# EAGLE design esquema (EAGLE 7.5.0)
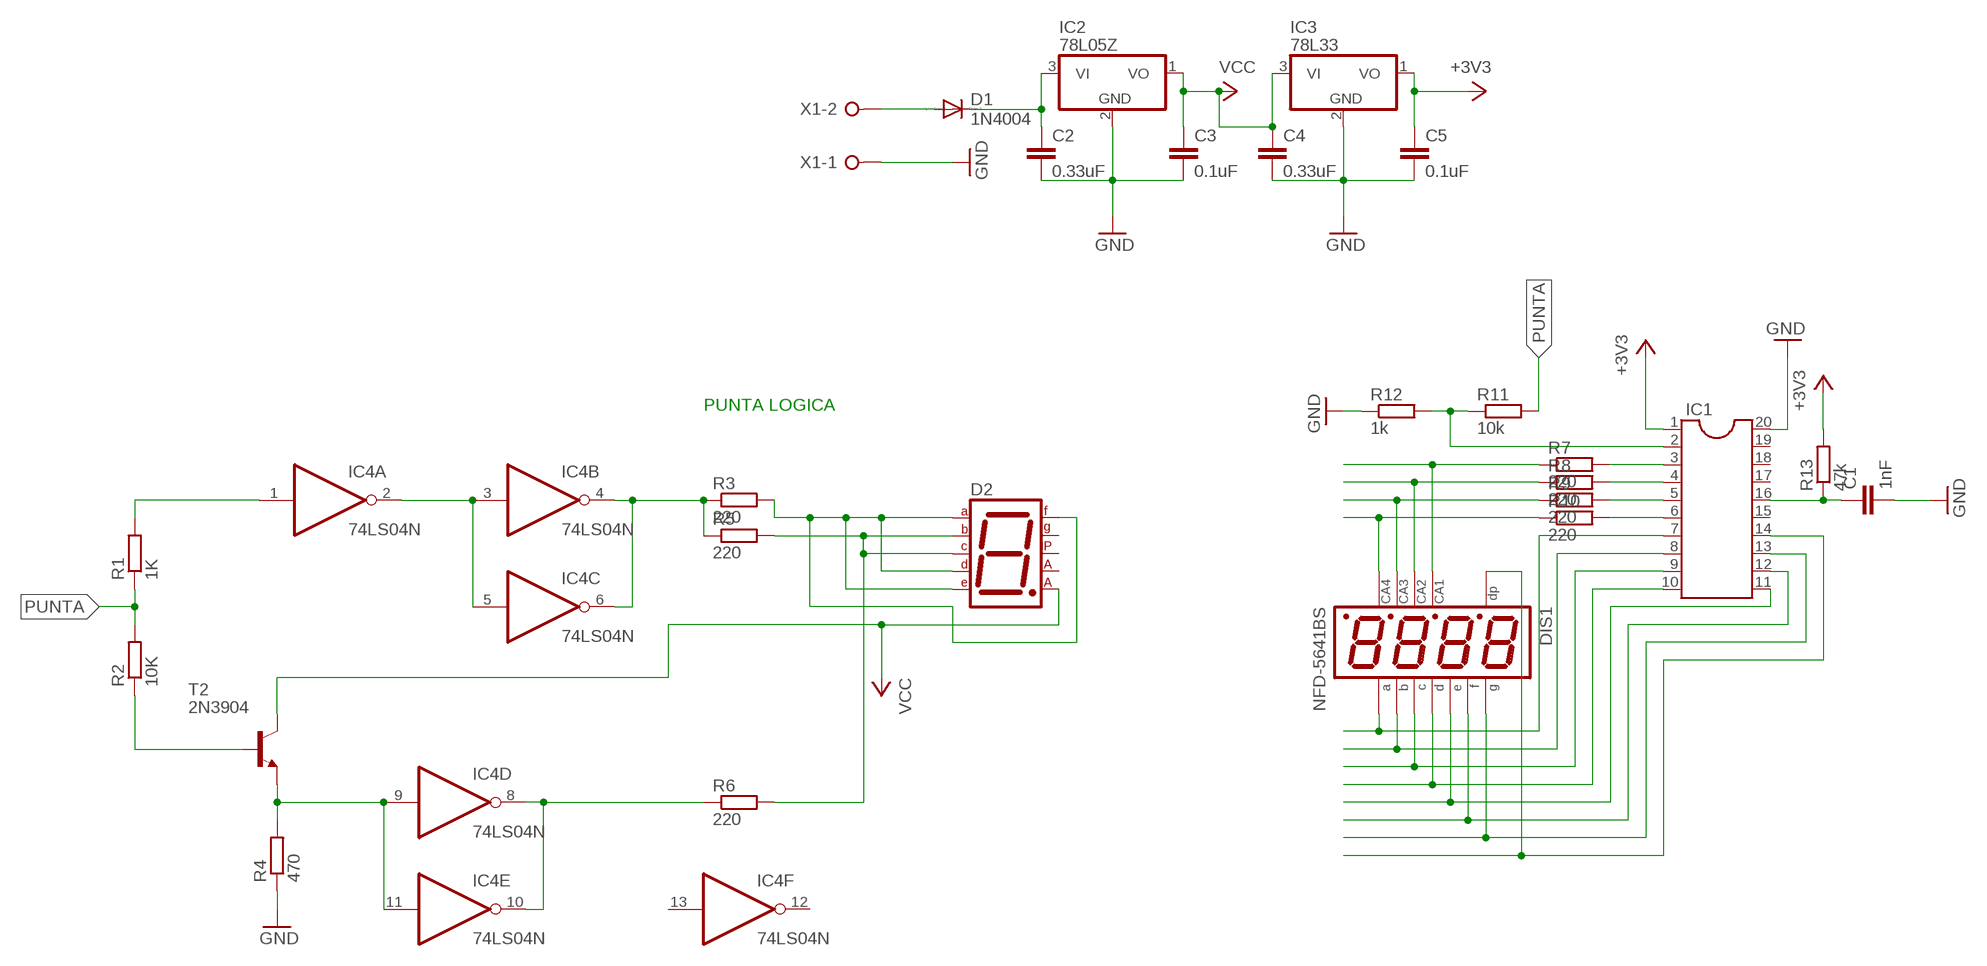
[diagram p0: schematic, sheet 1]

## Parts
C1  1nF  C-EU050-024X044  [C050-024X044]
C2  0.33uF  C-EU050-024X044  [C050-024X044]
C3  0.1uF  C-EU050-024X044  [C050-024X044]
C4  0.33uF  C-EU050-024X044  [C050-024X044]
C5  0.1uF  C-EU050-024X044  [C050-024X044]
D1  1N4004  [DO41-10]
D2  7SEG-CA  [7SEG-13]
DIS1  NFD-5641BS  [NFD-5641]
IC1  DIL20S  [SOCKET-20]
IC2  78L05Z  [TO92]
IC3  78L33  78L05Z  [TO92]
IC4  74LS04N  [DIL14]
R1  1K  R-EU_0207/7  [0207/7]
R2  10K  R-EU_0207/7  [0207/7]
R3  220  R-EU_0207/7  [0207/7]
R4  470  R-EU_0207/7  [0207/7]
R5  220  R-EU_0207/7  [0207/7]
R6  220  R-EU_0207/7  [0207/7]
R7  220  R-EU_0207/7  [0207/7]
R8  220  R-EU_0207/7  [0207/7]
R9  220  R-EU_0207/7  [0207/7]
R10  220  R-EU_0207/7  [0207/7]
R11  10k  R-EU_0207/7  [0207/7]
R12  1k  R-EU_0207/7  [0207/7]
R13  47k  R-EU_0207/7  [0207/7]
T2  2N3904  [TO92]
X1  W237-02P  [W237-132]

## Nets
+3V3: C5.1 IC1.1 IC3.1(VO) R13.2
GND: C1.2 C2.2 C3.2 C4.2 C5.2 IC1.20 IC2.2(GND) IC3.2(GND) R4.1 R12.1 X1.1
N$1: C1.1 IC1.16 R13.1
N$2: IC1.6 R10.2
N$3: IC1.5 R9.2
N$4: IC1.4 R8.2
N$5: IC1.3 R7.2
N$6: IC1.2 R11.1 R12.2
N$7: DIS1.P$12 R7.1
N$8: DIS1.P$9 R8.1
N$9: DIS1.P$8 R9.1
N$10: IC4.1(A:I) R1.2
N$11: IC4.2(A:O) IC4.3(B:I) IC4.5(C:I)
N$12: IC4.4(B:O) IC4.6(C:O) R3.1 R5.1
N$13: R2.1 T2.2(B)
N$14: IC4.9(D:I) IC4.11(E:I) R4.2 T2.3(E)
N$15: D2.1(E) D2.2(D) D2.7(A) D2.9(F) R3.2
N$16: IC4.8(D:O) IC4.10(E:O) R6.1
N$17: D2.4(C) D2.6(B) R5.2 R6.2
N$18: DIS1.P$6 R10.1
N$19: DIS1.P$11 IC1.7
N$20: DIS1.P$7 IC1.8
N$21: DIS1.P$4 IC1.9
N$22: DIS1.P$2 IC1.10
N$23: DIS1.P$1 IC1.11
N$24: DIS1.P$10 IC1.12
N$25: DIS1.P$5 IC1.13
N$26: DIS1.P$3 IC1.14
N$27: D1.A X1.2
N$28: C2.1 D1.C IC2.3(VI)
PUNTA: R1.1 R2.2 R11.2
VCC: C3.1 C4.1 D2.8(CA2) IC2.1(VO) IC3.3(VI) T2.1(C)
Unconnected: D2.3(CA1) D2.5(DP) D2.10(G) IC1.15 IC1.17 IC1.18 IC1.19 IC4.12(F:O) IC4.13(F:I)

## Notes on the sheet
- PUNTA LOGICA

## Power pins joined to a net without a drawn wire
GND: IC4.7(P:GND)
VCC: IC4.14(P:VCC)

## Library data of the parts
C1-C5 = rcl:C-EU: CAPACITOR, European symbol
D1 = diode:1N4004: DIODE general purpose rectifier, 1 A
D2 = special:7SEG-CA: 7-segment DISPLAY single anode, 13 mm
DIS1 = display-nfd:NFD-5641BS: Four Digit 0.56" CA Seven-Segment LED Display Futurlec part number: 7FR5641BS Created by RobG
IC1 = ic-package:DIL20: Dual In Line / Socket
IC2 IC3 = linear:78*: Positive VOLTAGE REGULATOR Source: http://cache.national.com/ds/LM/LM78L05.pdf http://www.fairchildsemi.com/ds/LM/LM7805.pdf
IC4 = 74xx-us:74*04: Hex INVERTER
R1-R13 = rcl:R-EU_: RESISTOR, European symbol
T2 = transistor:2N3904: NPN TRANSISTOR
X1 = con-wago-508:W237-02P: WAGO SREW CLAMP; OC_FARNELL: unknown; OC_NEWARK: unknown

## Board
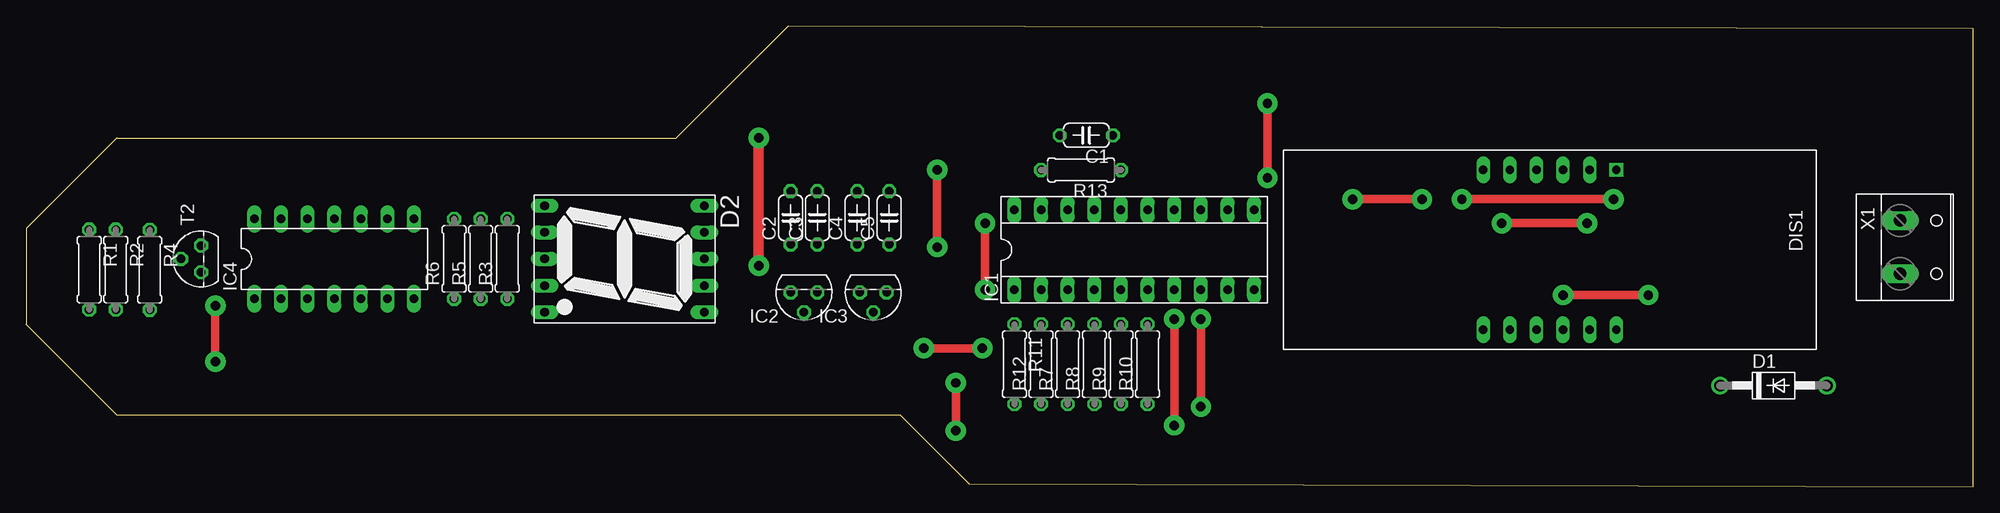
[diagram p1: board, top side]
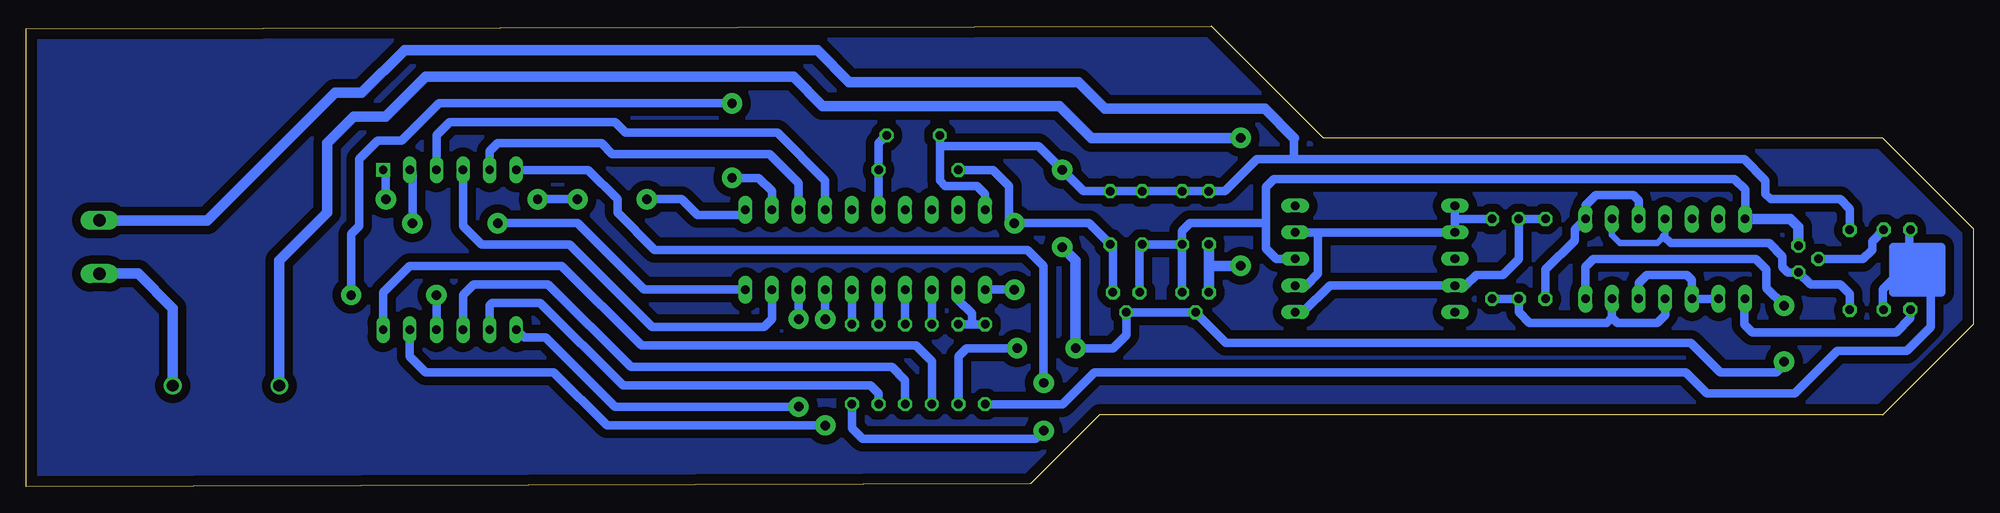
[diagram p2: board, bottom side, seen from below]

Size 185.67 x 43.94 mm. Coordinates in mm from the lower left corner, seen from the top.
Outline: 0,24.64 0,15.49 8.64,6.86 83.31,6.86 89.92,0.25 185.67,0 185.67,43.69 72.64,43.94 61.98,33.27 8.64,33.27 0,24.64
Copper layers (1*16): Top 0.035mm / dielectric 1.5mm / Bottom 0.035mm
Design rules "default": minimum track width 10mil, minimum drill 24mil, track to track 8mil, track to pad 8mil, pad to pad 8mil, via to via 8mil, smd to smd 8mil, copper to edge 40mil, drill to drill 8mil, minimum pad ring 10mil, minimum via ring 8mil, stop-mask expansion 4mil, vias tented up to drill 0mil, thermal gap 10mil

### Footprints (pad centres in the part's own frame; a part is rotated, then mirrored left to right if it is on the bottom)
C050-024X044 = drill 0.813 octagon: 1 -2.54,0; 2 2.54,0
DO41-10 = drill 1.118: A 5.08,0; C -5.08,0
7SEG-13 = drill 0.813 long: 1 -5.08,-7.62; 2 -2.54,-7.62; 3 0,-7.62; 4 2.54,-7.62; 5 5.08,-7.62; 6 5.08,7.62; 7 2.54,7.62; 8 0,7.62; 9 -2.54,7.62; 10 -5.08,7.62
NFD-5641 = drill 0.8 square: P$1 -6.35,-7.62 | drill 0.8 long: P$2 -3.81,-7.62; P$3 -1.27,-7.62; P$4 1.27,-7.62; P$5 3.81,-7.62; P$6 6.35,-7.62; P$7 6.35,7.62; P$8 3.81,7.62; P$9 1.27,7.62; P$10 -1.27,7.62; P$11 -3.81,7.62; P$12 -6.35,7.62
SOCKET-20 = drill 0.813 long: 1 -11.43,-3.81; 2 -8.89,-3.81; 3 -6.35,-3.81; 4 -3.81,-3.81; 5 -1.27,-3.81; 6 1.27,-3.81; 7 3.81,-3.81; 8 6.35,-3.81; 9 8.89,-3.81; 10 11.43,-3.81; 11 11.43,3.81; 12 8.89,3.81; 13 6.35,3.81; 14 3.81,3.81; 15 1.27,3.81; 16 -1.27,3.81; 17 -3.81,3.81; 18 -6.35,3.81; 19 -8.89,3.81; 20 -11.43,3.81
TO92 = drill 0.813 octagon: 1 -1.27,0; 2 0,1.905; 3 1.27,0
DIL14 = drill 0.813 long: 1 -7.62,-3.81; 2 -5.08,-3.81; 3 -2.54,-3.81; 4 0,-3.81; 5 2.54,-3.81; 6 5.08,-3.81; 7 7.62,-3.81; 8 7.62,3.81; 9 5.08,3.81; 10 2.54,3.81; 11 0,3.81; 12 -2.54,3.81; 13 -5.08,3.81; 14 -7.62,3.81
0207/7 = drill 0.813 octagon: 1 -3.81,0; 2 3.81,0
TO92' = drill 0.813 octagon: 1 1.27,0; 2 0,1.905; 3 -1.27,0
W237-132 = drill 1.194 long: 1 -2.54,-0.635; 2 2.54,-0.635

### Placement (x,y rotation side)
C1  101.09,33.53 180 top
C2  72.9,25.65 90 top
C3  75.44,25.65 90 top
C4  79.25,25.65 90 top
C5  82.3,25.65 90 top
D1  166.62,9.65 0 top
D2  57.06,21.73 270 top
DIS1  145.29,22.61 180 top
IC1  105.66,22.61 0 top
IC2  74.17,18.54 180 top
IC3  80.77,18.54 180 top
IC4  29.37,21.73 0 top
R1  6,20.72 270 top
R2  8.54,20.72 270 top
R3  45.88,21.73 90 top
R4  11.78,20.69 270 top
R5  43.34,21.73 90 top
R6  40.8,21.73 90 top
R7  99.31,11.68 90 top
R8  101.85,11.68 90 top
R9  104.39,11.68 90 top
R10  106.93,11.68 90 top
R11  94.23,11.68 270 top
R12  96.77,11.68 90 top
R13  100.58,30.23 180 top
T2  2N3904  [TO92']  16.67,21.73 90 top
X1  179.32,22.86 270 top

### Tracks (layer width: path | path; a pad name or v marks a point on that pad's centre or on a via)
+3V3  (via drill 0.9 pad 1.93)
  Top 0.813: v91.44,18.8 v91.44,25.15
  Bottom 0.813: R13.2 93.47,30.23 91.95,28.7 91.95,25.65 v91.44,25.15 84.33,25.15 C5.1 82.04,22.86 IC3.1 | IC1.1 v91.44,18.8
GND  (via drill 0.9 pad 1.93)
  Top 0.813: v18.03,17.27 v18.03,11.94 | v91.19,13.21 v85.6,13.21 | v86.87,22.86 v86.87,30.23
  Bottom 0.813: IC4.7 36.99,20.97 36.23,21.73 20.73,21.73 19.72,20.72 19.72,18.96 v18.03,17.27 | C1.2 98.55,32.51 | 98.55,32.51 98.55,29.21 98.04,28.7 95,28.7 94.23,27.94 IC1.20 | 65.02,31.24 68.33,31.24 71.37,28.19 C2.2 C3.2 C4.2 C5.2 84.84,28.19 v86.87,30.23 89.15,32.51 98.55,32.51 | 65.02,31.24 21.84,31.24 19.81,29.21 19.81,27.94 19.3,27.43 12.7,27.43 11.78,26.51 R4.1 | v18.03,11.94 18.03,11.68 18.8,10.92 24.13,10.92 26.92,13.72 71.25,13.72 IC2.2 IC3.2 80.77,14.48 82.04,13.21 v85.6,13.21 | R12.1 96.77,12.45 96.01,13.21 v91.19,13.21 | 64.77,33.27 64.77,31.5 65.02,31.24
  Bottom 1.016: 64.77,33.27 67.56,36.07 82.8,36.07 85.34,38.61 107.19,38.61 110.24,41.66 149.61,41.66 153.67,37.59 156.21,37.59 168.4,25.4 X1.1 | v85.6,13.21 85.6,21.59 v86.87,22.86
N$1
  Bottom 0.813: IC1.16 R13.1 104.39,32.77 C1.1
N$2
  Bottom 0.813: IC1.6 R10.2
N$3
  Bottom 0.813: IC1.5 R9.2
N$4
  Bottom 0.813: IC1.4 R8.2
N$5
  Bottom 0.813: IC1.3 R7.2
N$6
  Bottom 0.813: R11.1 95.5,15.49 | 95.5,15.49 R12.2 | IC1.2 96.77,17.78 95.5,16.51 95.5,15.49
N$7
  Bottom 0.813: R7.1 99.31,11.94 100.84,13.46 127,13.46 134.62,21.08 149.1,21.08 151.64,18.54 DIS1.P$12
N$8
  Bottom 0.813: R8.1 101.85,10.16 103.12,11.43 128.02,11.43 135.89,19.3 143,19.3 144.02,18.29 DIS1.P$9
N$9
  Bottom 0.813: R9.1 104.39,8.89 105.16,9.65 128.78,9.65 136.65,17.53 141.22,17.53 141.48,17.27 DIS1.P$8
N$10
  Bottom 0.813: R1.2 6,16.1 7.37,14.73 21.08,14.73 21.84,15.49 21.84,17.83 IC4.1
N$11
  Bottom 0.813: IC4.2 IC4.3 26.83,19.7 27.34,20.21 31.15,20.21 31.91,19.45 IC4.5
N$12
  Bottom 0.813: IC4.4 29.37,16.4 30.13,15.64 33.94,15.64 34.45,16.14 | 34.45,16.14 IC4.6 | 34.45,16.14 34.96,15.64 42.32,15.64 43.34,16.65 R5.1 R3.1
N$13
  Bottom 0.813: T2.2 10.53,21.73 9.65,22.61 9.65,23.42 R2.1
N$14
  Bottom 0.61: IC4.11 29.37,24.02 29.5,23.89 30.13,23.26 33.69,23.26 34.45,24.02 IC4.9
  Bottom 0.813: 29.5,23.89 28.86,23.26 19.46,23.26 18.19,21.99 18.19,20.97 17.69,20.46 T2.3 15.51,19.3 12.7,19.3 11.78,18.38 R4.2
N$15
  Bottom 0.813: 64.93,19.19 D2.7 63.61,19.19 62.48,20.32 62.48,24.27 | D2.9 63.91,24.27 63.79,24.15 63.66,24.27 62.48,24.27 | 62.48,24.27 D2.2 49.44,25.4 | D2.1 49.44,25.4 | R3.2 49.29,25.54 49.44,25.4
N$16
  Bottom 0.813: IC4.10 31.91,27.32 32.42,27.83 35.97,27.83 36.99,26.81 IC4.8 38.01,24.53 38.01,23.51 40.8,20.72 R6.1
N$17
  Bottom 0.813: R6.2 R5.2 43.34,21.73 44.86,20.21 47.4,20.21 48.42,19.19 D2.4 61.37,19.19 63.91,16.65 D2.6
N$18  (via drill 0.9 pad 1.93)
  Top 0.813: v88.65,5.33 v88.65,9.91
  Bottom 0.813: DIS1.P$6 132.08,30.23 129.29,27.43 129.29,26.16 125.73,22.61 90.17,22.61 88.65,21.08 v88.65,9.91 | R10.1 106.93,5.59 105.92,4.57 89.41,4.57 v88.65,5.33
N$19  (via drill 0.9 pad 1.93)
  Top 0.813: v109.47,16 v109.47,5.84
  Bottom 0.813: IC1.7 v109.47,16 | DIS1.P$11 149.1,12.45 147.57,10.92 135.38,10.92 130.3,5.84 v109.47,5.84
N$20  (via drill 0.9 pad 1.93)
  Top 0.813: v112.01,16 v112.01,7.62
  Bottom 0.813: IC1.8 v112.01,16 | v112.01,7.62 129.54,7.62 136.14,14.22 138.18,14.22 DIS1.P$7
N$21
  Bottom 0.813: IC1.9 114.55,16 115.32,15.24 125.98,15.24 133.86,23.11 142.24,23.11 144.02,24.89 DIS1.P$4
N$22  (via drill 0.9 pad 1.93)
  Top 0.813: v140.72,25.15 v148.84,25.15
  Bottom 0.813: IC1.10 126.75,18.8 133.1,25.15 v140.72,25.15 | v148.84,25.15 148.84,29.97 DIS1.P$2
N$23  (via drill 0.9 pad 1.93)
  Top 0.813: v136.91,27.43 v151.38,27.43 | v133.1,27.43 v126.49,27.43
  Bottom 0.813: v151.38,27.43 151.38,29.97 DIS1.P$1 | v136.91,27.43 v133.1,27.43 | v126.49,27.43 123.19,27.43 121.67,25.91 117.6,25.91 IC1.11
N$24  (via drill 0.9 pad 1.93)
  Top 0.813: v154.69,18.29 v146.56,18.29 | v118.36,36.58 v118.36,29.46
  Bottom 0.813: IC1.12 114.55,28.19 115.82,29.46 v118.36,29.46 | v146.56,18.29 DIS1.P$10 | v154.69,18.29 154.69,24.13 153.92,24.89 153.92,31.24 152.15,33.02 149.86,33.02 146.3,36.58 v118.36,36.58
N$25
  Bottom 0.813: IC1.13 112.01,28.96 114.81,31.75 129.79,31.75 130.81,32.77 140.72,32.77 141.48,32 DIS1.P$5 141.73,30.48
N$26
  Bottom 0.813: IC1.14 109.47,29.21 114.05,33.78 128.52,33.78 129.54,34.8 145.29,34.8 146.56,33.53 DIS1.P$3
N$27
  Bottom 1.016: X1.2 175.01,20.32 171.7,17.02 D1.A
N$28  (via drill 0.9 pad 1.93)
  Top 1.016: v69.85,21.08 v69.85,33.27
  Bottom 1.016: D1.C 161.54,21.59 156.97,26.16 156.97,32.77 154.43,35.31 151.38,35.31 147.57,39.12 112.52,39.12 109.73,36.32 87.12,36.32 84.07,33.27 v69.85,33.27 | C2.1 72.9,21.08 | 72.9,21.08 v69.85,21.08 | IC2.3 72.9,21.08
N$29
  pour Bottom (isolate 0.813): 0.51,24.38 8.89,32.77 62.23,32.77 72.9,43.43 185.42,43.43 185.42,0.51 90.17,0.51 83.31,7.37 8.64,7.37 0.51,15.49
PUNTA
  Bottom 0.813: R11.2 86.87,7.87 83.82,10.92 27.43,10.92 25.4,8.89 17.02,8.89 12.95,12.95 6.35,12.95 4.06,15.24 4.06,18.54 4.57,19.05 | R1.1 6.1,24.53 6.1,22.86 3.05,22.86 3.05,18.54 7.62,18.54 7.62,22.86 3.81,22.86 3.81,19.05 4.57,19.05 | 4.57,19.05 7.11,19.05 7.11,22.1 4.32,22.1 4.32,19.56 6.35,19.56 6.35,21.59 4.83,21.59 4.83,20.32 5.84,20.32 | 5.84,20.32 5.84,20.07 | 5.84,20.32 5.84,20.83 | 5.84,20.83 5.33,20.83 | 5.84,20.83 6.6,20.83 8.64,18.8 8.64,17 R2.2
VCC
  Bottom 0.813: IC4.14 21.75,28.34 22.77,29.35 66.71,29.35 67.47,28.59 67.47,25.15 | D2.8 66.45,21.73 67.47,22.75 67.47,25.15 | IC2.1 C3.1 | C3.1 75.44,24.38 74.68,25.15 67.47,25.15 | C3.1 C4.1 79.5,22.86 IC3.3
  Bottom 1.016: T2.1 16.67,24.78 17.43,25.54 IC4.14